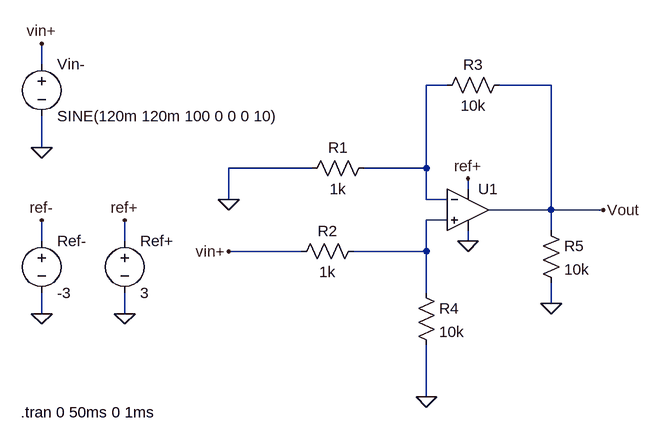
[diagram p0: schematic Diff.asc]
Diff.asc, the LTspice schematic file:
Version 4
SHEET 1 880 680
WIRE -448 -96 -448 -128
WIRE 176 -64 144 -64
WIRE 336 -64 256 -64
WIRE -448 32 -448 -16
WIRE -32 64 -160 64
WIRE 144 64 144 -64
WIRE 144 64 48 64
WIRE 208 96 208 80
WIRE -160 112 -160 64
WIRE 144 112 144 64
WIRE 176 112 144 112
WIRE 336 128 336 -64
WIRE 336 128 240 128
WIRE 416 128 336 128
WIRE 176 144 144 144
WIRE 336 160 336 128
WIRE -448 176 -448 144
WIRE -320 176 -320 144
WIRE 208 176 208 160
WIRE -48 192 -160 192
WIRE 144 192 144 144
WIRE 144 192 32 192
WIRE 144 256 144 192
WIRE 336 272 336 240
WIRE -448 288 -448 256
WIRE -320 288 -320 256
WIRE 144 416 144 336
FLAG 144 416 0
FLAG -320 288 0
FLAG 416 128 Vout
FLAG 208 80 ref+
FLAG -320 144 ref+
FLAG -448 32 0
FLAG -448 -128 vin+
FLAG -448 288 0
FLAG -448 144 ref-
FLAG -160 192 vin+
FLAG -160 112 0
FLAG 208 176 0
FLAG 336 272 0
SYMBOL Opamps\\UniversalOpamp2 208 128 R0
SYMATTR InstName U1
SYMBOL res 64 48 R90
WINDOW 0 0 56 VBottom 2
WINDOW 3 32 56 VTop 2
SYMATTR InstName R1
SYMATTR Value 1k
SYMBOL res 48 176 R90
WINDOW 0 0 56 VBottom 2
WINDOW 3 32 56 VTop 2
SYMATTR InstName R2
SYMATTR Value 1k
SYMBOL res 272 -80 R90
WINDOW 0 0 56 VBottom 2
WINDOW 3 32 56 VTop 2
SYMATTR InstName R3
SYMATTR Value 10k
SYMBOL res 128 240 R0
SYMATTR InstName R4
SYMATTR Value 10k
SYMBOL voltage -320 160 R0
WINDOW 123 0 0 Left 2
WINDOW 39 0 0 Left 2
SYMATTR InstName Ref+
SYMATTR Value 3
SYMBOL voltage -448 -112 R0
WINDOW 123 0 0 Left 2
WINDOW 39 0 0 Left 2
SYMATTR InstName Vin-
SYMATTR Value SINE(120m 120m 100 0 0 0 10)
SYMBOL voltage -448 160 R0
WINDOW 123 0 0 Left 2
WINDOW 39 0 0 Left 2
SYMATTR InstName Ref-
SYMATTR Value -3
SYMBOL res 320 144 R0
SYMATTR InstName R5
SYMATTR Value 10k
TEXT -480 440 Left 2 !.tran 0 50ms 0 1ms

The netlist it stands for:
* Diff.asc
XU1 N002 N001 ref+ 0 Vout level.2 Avol=1Meg GBW=10Meg Slew=10Meg ilimit=25m rail=0 Vos=0 phimargin=45 en=0 enk=0 in=0 ink=0 Rin=500Meg  ; pins IN+ IN- V+ V- OUT
R1 N001 0 1k
R2 N002 vin+ 1k
R3 Vout N001 10k
R4 N002 0 10k
V§Ref+ ref+ 0 3
Vin- vin+ 0 SINE(120m 120m 100 0 0 0 10)
V§Ref- ref- 0 -3
R5 Vout 0 10k
.tran 0 50ms 0 1ms
.lib UniversalOpamps2.sub
.backanno
.end